# Altium schematic sheet Sheet1.SchDoc: Small Keyboard
size A; ApprovedBy: Wenhoo Lee; CheckedBy: Wenhoo Lee; Author: Wenhoo Lee; CompanyName: Coreduino; DrawnBy: Wenhoo Lee; Engineer: Wenhoo Lee; Organization: Coreduino; Address1: Shandong; Address2: Taian; Address3: Dongping; Address4: Wangshan No.03; DocumentNumber: 1; Revision: 1; SheetNumber: 1; SheetTotal: 2
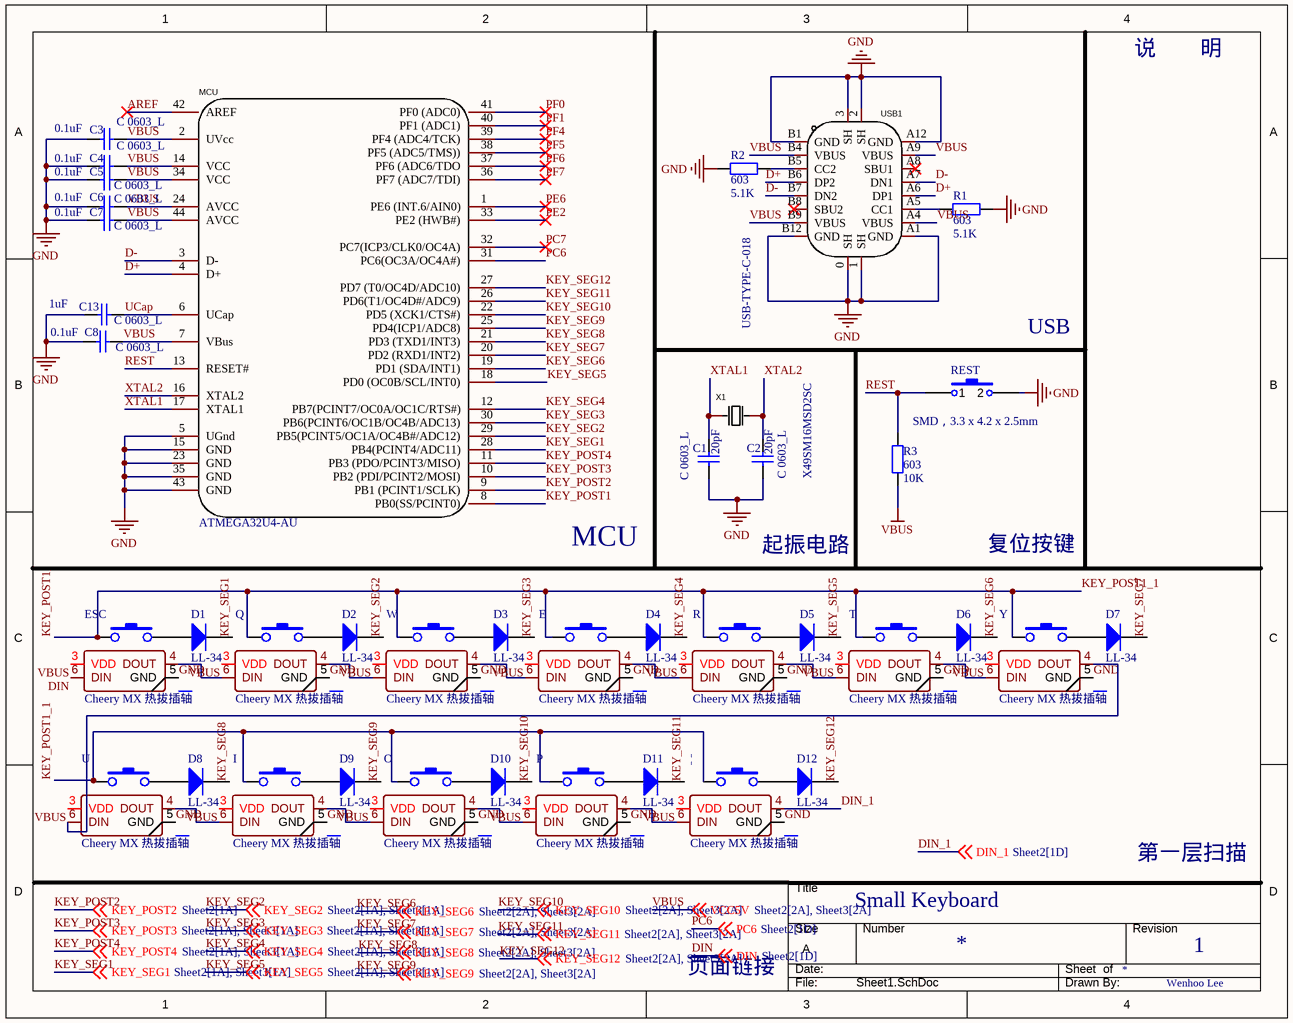
[diagram p0: Sheet1.SchDoc]

## Parts
C1  C 0603_L  value 20pF  [C 0603_L]
C2  C 0603_L  value 20pF  [C 0603_L]
C3  C 0603_L  value 0.1uF  [C 0603_L]
C4  C 0603_L  value 0.1uF  [C 0603_L]
C5  C 0603_L  value 0.1uF  [C 0603_L]
C6  C 0603_L  value 0.1uF  [C 0603_L]
C7  C 0603_L  value 0.1uF  [C 0603_L]
C8  C 0603_L  value 0.1uF  [C 0603_L]
C13  C 0603_L  value 1uF  [C 0603_L]
D1  LL-34  [LL-34_L3.7-W1.6-RD]
D2  LL-34  [LL-34_L3.7-W1.6-RD]
D3  LL-34  [LL-34_L3.7-W1.6-RD]
D4  LL-34  [LL-34_L3.7-W1.6-RD]
D5  LL-34  [LL-34_L3.7-W1.6-RD]
D6  LL-34  [LL-34_L3.7-W1.6-RD]
D7  LL-34  [LL-34_L3.7-W1.6-RD]
D8  LL-34  [LL-34_L3.7-W1.6-RD]
D9  LL-34  [LL-34_L3.7-W1.6-RD]
D10  LL-34  [LL-34_L3.7-W1.6-RD]
D11  LL-34  [LL-34_L3.7-W1.6-RD]
D12  LL-34  [LL-34_L3.7-W1.6-RD]
E  Cheery MX 热拔插轴  [MX_SW-HOTPLUG]
ESC  Cheery MX 热拔插轴  [MX_SW-HOTPLUG]
I  Cheery MX 热拔插轴  [MX_SW-HOTPLUG]
MCU  ATMEGA32U4-AU  [QFP-44_L10.0-W10.0-P0.80-LS13.2-BL]
O  Cheery MX 热拔插轴  [MX_SW-HOTPLUG]
P  Cheery MX 热拔插轴  [MX_SW-HOTPLUG]
Q  Cheery MX 热拔插轴  [MX_SW-HOTPLUG]
R  Cheery MX 热拔插轴  [MX_SW-HOTPLUG]
R1  603  value 5.1K  [0603P]
R2  603  value 5.1K  [0603P]
R3  603  value 10K  [R 0603_L]
REST  SMD，3.3 x 4.2 x 2.5mm  [SMD-3.2*4.2]
T  Cheery MX 热拔插轴  [MX_SW-HOTPLUG]
U  Cheery MX 热拔插轴  [MX_SW-HOTPLUG]
USB1  USB-TYPE-C-018  [USB-C_SMD-TYPE-C-31-M-12]
W  Cheery MX 热拔插轴  [MX_SW-HOTPLUG]
X1  X49SM16MSD2SC  [HC-49S_L11.4-W4.8]
Y  Cheery MX 热拔插轴  [MX_SW-HOTPLUG]
|  Cheery MX 热拔插轴  [MX_SW-HOTPLUG]

## Nets
GND: C1.1 C2.1 C3.1 C4.1 C5.1 C6.1 C7.1 C8.1 C13.1 E.5(GND) ESC.5(GND) I.5(GND) MCU.5(UGnd) MCU.15(GND) MCU.23(GND) MCU.35(GND) MCU.43(GND) O.5(GND) P.5(GND) Q.5(GND) R.5(GND) R1.2 R2.1 REST.2 T.5(GND) U.5(GND) USB1.0(SH) USB1.1(SH) USB1.2(SH) USB1.3(SH) USB1.A1(GND) USB1.A12(GND) USB1.B1(GND) USB1.B12(GND) W.5(GND) Y.5(GND) |.5(GND)
VBUS: C3.2 C4.2 C5.2 C6.2 C7.2 C8.2 E.3(VDD) ESC.3(VDD) I.3(VDD) MCU.2(UVcc) MCU.7(VBus) MCU.14(VCC) MCU.24(AVCC) MCU.34(VCC) MCU.44(AVCC) O.3(VDD) P.3(VDD) Q.3(VDD) R.3(VDD) R3.1 T.3(VDD) U.3(VDD) USB1.A4(VBUS) USB1.A9(VBUS) USB1.B4(VBUS) USB1.B9(VBUS) W.3(VDD) Y.3(VDD) |.3(VDD) ; off-sheet VCC5V  [also labelled VCC5V]
AREF: MCU.42(AREF)
D+: MCU.4(D+) USB1.A6(DP1) USB1.B6(DP2)
D-: MCU.3(D-) USB1.A7(DN1) USB1.B7(DN2)
DIN: ESC.6(DIN) ; off-sheet DIN
DIN_1: |.4(DOUT) ; off-sheet DIN_1
KEY_POST1: E.1 ESC.1 I.1 MCU.8(PB0(SS/PCINT0)) O.1 P.1 Q.1 R.1 T.1 U.1 W.1 Y.1 |.1  [also labelled KEY_POST1_1]
KEY_POST2: MCU.9(PB1_(PCINT1/SCLK)) ; off-sheet KEY_POST2
KEY_POST3: MCU.10(PB2_(PDI/PCINT2/MOSI)) ; off-sheet KEY_POST3
KEY_POST4: MCU.11(PB3_(PDO/PCINT3/MISO)) ; off-sheet KEY_POST4
KEY_SEG1: D1.2(K) MCU.28(PB4(PCINT4/ADC11)) ; off-sheet KEY_SEG1
KEY_SEG2: D2.2(K) MCU.29(PB5(PCINT5/OC1A/OC4B#/ADC12)) ; off-sheet KEY_SEG2
KEY_SEG3: D3.2(K) MCU.30(PB6(PCINT6/OC1B/OC4B/ADC13)) ; off-sheet KEY_SEG3
KEY_SEG4: D4.2(K) MCU.12(PB7(PCINT7/OC0A/OC1C/RTS#)) ; off-sheet KEY_SEG4
KEY_SEG5: D5.2(K) MCU.18(PD0_(OC0B/SCL/INT0)) ; off-sheet KEY_SEG5
KEY_SEG6: D6.2(K) MCU.19(PD1_(SDA/INT1)) ; off-sheet KEY_SEG6
KEY_SEG7: D7.2(K) MCU.20(PD2_(RXD1/INT2)) ; off-sheet KEY_SEG7
KEY_SEG8: D8.2(K) MCU.21(PD3_(TXD1/INT3)) ; off-sheet KEY_SEG8
KEY_SEG9: D9.2(K) MCU.25(PD4(ICP1/ADC8)) ; off-sheet KEY_SEG9
KEY_SEG10: D10.2(K) MCU.22(PD5_(XCK1/CTS#)) ; off-sheet KEY_SEG10
KEY_SEG11: D11.2(K) MCU.26(PD6(T1/OC4D#/ADC9)) ; off-sheet KEY_SEG11
KEY_SEG12: D12.2(K) MCU.27(PD7_(T0/OC4D/ADC10)) ; off-sheet KEY_SEG12
PC6: MCU.31(PC6(OC3A/OC4A#)) ; off-sheet PC6
PC7: MCU.32(PC7(ICP3/CLK0/OC4A))
PE2: MCU.33(PE2_(HWB#))
PE6: MCU.1(PE6_(INT.6/AIN0))
PF0: MCU.41(PF0_(ADC0))
PF1: MCU.40(PF1_(ADC1))
PF4: MCU.39(PF4_(ADC4/TCK))
PF5: MCU.38(PF5_(ADC5/TMS)))
PF6: MCU.37(PF6_(ADC6/TDO)
PF7: MCU.36(PF7_(ADC7/TDI))
REST: MCU.13(RESET#) R3.2 REST.1
UCap: C13.2 MCU.6(UCap)
XTAL1: C1.2 MCU.17(XTAL1) X1.1(OSC1)
XTAL2: C2.2 MCU.16(XTAL2) X1.2(OSC2)
NetD1_1: D1.1(A) ESC.2
NetD2_1: D2.1(A) Q.2
NetD3_1: D3.1(A) W.2
NetD4_1: D4.1(A) E.2
NetD5_1: D5.1(A) R.2
NetD6_1: D6.1(A) T.2
NetD7_1: D7.1(A) Y.2
NetD8_1: D8.1(A) U.2
NetD9_1: D9.1(A) I.2
NetD10_1: D10.1(A) O.2
NetD11_1: D11.1(A) P.2
NetD12_1: D12.1(A) |.2
NetE_4: E.4(DOUT) R.6(DIN)
NetE_6: E.6(DIN) W.4(DOUT)
NetESC_4: ESC.4(DOUT) Q.6(DIN)
NetI_4: I.4(DOUT) O.6(DIN)
NetI_6: I.6(DIN) U.4(DOUT)
NetO_4: O.4(DOUT) P.6(DIN)
NetP_4: P.4(DOUT) |.6(DIN)
NetQ_4: Q.4(DOUT) W.6(DIN)
NetR1_1: R1.1 USB1.A5(CC1)
NetR2_2: R2.2 USB1.B5(CC2)
NetR_4: R.4(DOUT) T.6(DIN)
NetT_4: T.4(DOUT) Y.6(DIN)
NetU_6: U.6(DIN) Y.4(DOUT)

Not connected (* = marked no-connect by the designer): USB1 A8(SBU1)* B8(SBU2)*

## Notes on the sheet
- 说        明
- USB
- MCU
- 起振电路
- 复位按键
- 第一层扫描
- 页面链接
- DWG. NO.
- REV.
- SHT.
- REVISION
- DESCRIPTION
- DATE
- APPROVED
- THIS DOCUMENT AND THE DATA DISCLOSED HEREIN OR HEREWITH IS THE PROPERTY OF ALTIUM LIMITED AND MAY BE FREELY DISTRIBUTED IN WHOLE. NO RIGHTS ARE RESERVED OR EXPRESS OR IMPLIED WARANTEE GIVEN.
- ENG:
- DSN:
- APPROVALS
- PROJECT
- DOCUMENT REVISION:
- DESIGN ITEM:
- CHK:
- BOM:
- REFERENCE DOCUMENTS
- PROJECT REVISION:
- TITLE
- FAB DWG:
- PCB DWG:
- ASSY DWG:
- SCALE:
- SIZE
- C
- CAGE CODE
- FILE NAME
- DWG NO.
- SHEET
- OF
- REV

## Library data of the parts
C1-C8 C13 = C 0603_L: 贴片电容器（Capacitor）; Published: 8-Jun-2000; LatestRevisionDate: 17-Jul-2002; LatestRevisionNote: Re-released for DXP Platform.; PackageReference: RAD-0.3; Publisher: Altium Limited; PackageDescription: Radial Cap, Thru-Hole; 2 Leads; 0.3 in Pin Spacing
D1-D12 = LL4148: 开关二极管（Switching diode）; Published: 8-Jun-2000; LatestRevisionDate: 17-Jul-2002; LatestRevisionNote: Re-released for DXP Platform.; PackageVersion: Sep-1996; PackageReference: SMC; Publisher: Altium Limited; PackageDescription: DO-214-AB/SMC; 2 C-Bend Leads; Body 7.9 x 5.9 mm, inc. leads (LxW); Code_JEDEC: DO-214-AB
E ESC I O P Q R T U W Y | = Cheery MX 热拔插轴: 机械键盘轴（Cheery MX）
MCU = ATMEGA32U4-AU: MCU，ATMEGA32U4-AU; Manufacturer: MICROCHIP(美国微芯); Add into BOM: yes; CPU Core: AVR; Maximum Frequency: 16MHz; Supply Voltage Range: 2.7V~5.5V; Internal Oscillator: 有; Program FLASH Size: 16K@x16bit; RAM Size: 2.5KB; EEPROM/Data FLASH Size: 1KB; GPIO Ports Number: 26; ADC (Units/Channels/bits): 1@x12ch/10bit; Peripherals / Functions / Protocol Stacks: 欠压检测/复位；看门狗；POR；PWM; Name: ATMEGA32U4-AU; Symbol: ATMEGA32U4-AU; Device: ATMEGA32U4-AU; LCSC Part Name: AVR 16MHz 闪存：16K@x16bit RAM：2.5KB; Supplier Part: C44854; Manufacturer Part: ATMEGA32U4-AU; Supplier Footprint: QFP-44_10x10x08P; JLCPCB Part Class: Extended Part; Datasheet: https://atta.szlcsc.com/upload/public/pdf/source/20150811/1457707338800.pdf; Supplier: LCSC; Convert to PCB: yes; Operating Temperature Range: -40℃~+85℃
R1 R2 = R 0603_P: 贴片电阻（Resistor）; Published: 8-Jun-2000; LatestRevisionDate: 17-Jul-2002; LatestRevisionNote: Re-released for DXP Platform.; PackageReference: AXIAL-0.4; Publisher: Altium Limited; PackageDescription: Axial Device, Thru-Hole; 2 Leads; 0.4 in Pin Spacing
R3 = R 0603_L: 贴片电阻（Resistor）; Published: 8-Jun-2000; LatestRevisionDate: 17-Jul-2002; LatestRevisionNote: Re-released for DXP Platform.; PackageReference: AXIAL-0.4; Publisher: Altium Limited; PackageDescription: Axial Device, Thru-Hole; 2 Leads; 0.4 in Pin Spacing
REST = 260GF: 轻触开关（Touch Switch）; Published: 24-Mar-1999; LatestRevisionDate: 17-Jul-2002; LatestRevisionNote: Re-released for DXP Platform.; PackageReference: SPST-2; Publisher: Altium Limited; PackageDescription: Switch; 2 Leads
USB1 = USB-TYPE-C-018: 通用通信总线接口（USB）,16pin; Manufacturer: DEALON(德艺隆); Add into BOM: yes; Connector Type: Type-C; Gender: 母座; Number of Contacts: 16; Number of Ports: 1; Current Rating - Power (Max): 3A; Name: USB-TYPE-C-018; Symbol: USB-TYPE-C-018; Device: USB-TYPE-C-018; LCSC Part Name: USB-TYPE-C-018; Supplier Part: C2927038; Manufacturer Part: USB-TYPE-C-018; Supplier Footprint: SMD; JLCPCB Part Class: Extended Part; Datasheet: https://atta.szlcsc.com/upload/public/pdf/source/20211217/CCD3D517E355E8E0CC52ABD8D5784AD8.pdf; Supplier: LCSC; Convert to PCB: yes; Standard: -; Mounting Style: 卧贴; Operating Temperature Range: -25℃~+85℃
X1 = X49SM16MSD2SC: 无源晶振，2PIN; Manufacturer: YXC(扬兴晶振); Name: 16MHz; Add into BOM: yes; Crystal Type: 49SMD; Value: 16MHz; Frequency Tolerance: ±20ppm; Frequency Stability: ±30ppm; Load Capacitance: 20pF; Symbol: X49SM16MSD2SC; Device: X49SM16MSD2SC; LCSC Part Name: HC-49SMD 16MHz ±20ppm 20pF; Supplier Part: C12676; Manufacturer Part: X49SM16MSD2SC; Supplier Footprint: HC-49S-SMD-2P; JLCPCB Part Class: Extended Part; Datasheet: https://atta.szlcsc.com/upload/public/pdf/source/20210329/C106809_0E91E60850A780B284B63D653DC40EA4.pdf; Supplier: LCSC; Convert to PCB: yes; Operating Temperature: -20℃~+70℃